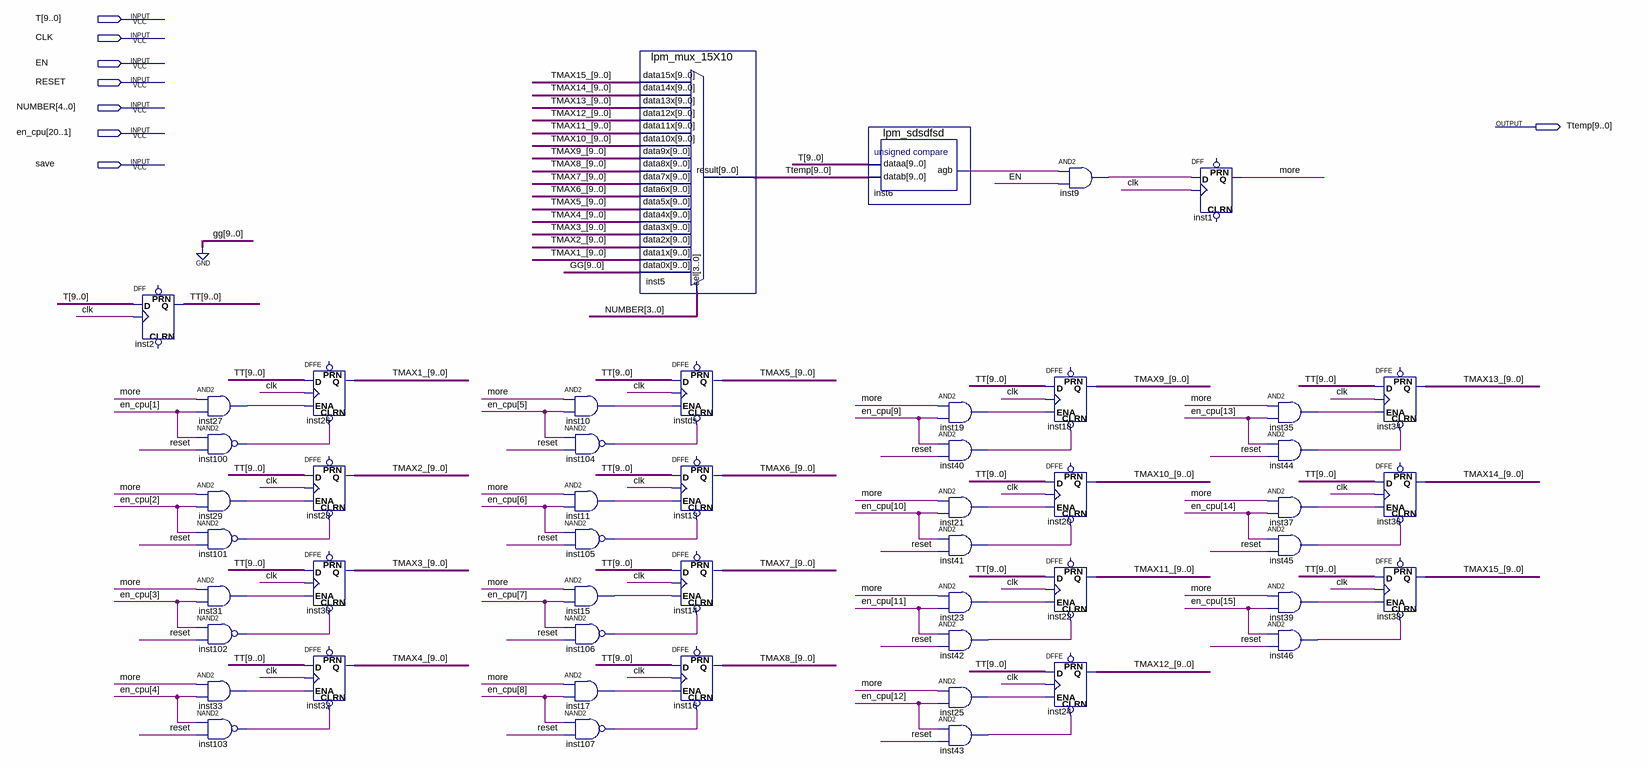
[diagram p0: schematic sheet]
// Quartus schematic Tmax.bdf as structural Verilog: 50 symbols, 8 pins
module Tmax (
  input  [9:0] T,
  input  CLK,
  input  EN,
  input  RESET,
  input  [4:0] NUMBER,
  input  [20:1] en_cpu,
  input  save,
  output [9:0] Ttemp
);

  wire inst6_agb, inst9_out, inst10_out, inst11_out, inst15_out, inst17_out, inst19_out, inst21_out,
       inst23_out, inst25_out, inst27_out, inst29_out, inst31_out, inst33_out, inst35_out, inst37_out,
       inst39_out, inst40_out, inst41_out, inst42_out, inst43_out, inst44_out, inst45_out, inst46_out,
       inst100_out, inst101_out, inst102_out, inst103_out, inst104_out, inst105_out, inst106_out,
       inst107_out, more;
  wire [9:0] TMAX1_, TMAX2_, TMAX3_, TMAX4_, TMAX5_, TMAX6_, TMAX7_, TMAX8_, TMAX9_, TMAX10_, TMAX11_,
       TMAX12_, TMAX13_, TMAX14_, TMAX15_, TT;

  DFF inst2[9:0] (.CLK(CLK), .D(T), .Q(TT));  // open: CLRN, PRN
  and inst27 (inst27_out, more, en_cpu[1]);
  nand inst100 (inst100_out, en_cpu[1], RESET);
  and inst29 (inst29_out, more, en_cpu[2]);
  nand inst101 (inst101_out, en_cpu[2], RESET);
  and inst31 (inst31_out, more, en_cpu[3]);
  nand inst102 (inst102_out, en_cpu[3], RESET);
  and inst33 (inst33_out, more, en_cpu[4]);
  nand inst103 (inst103_out, en_cpu[4], RESET);
  DFFE inst26[9:0] (.CLRN(inst100_out), .D(TT), .CLK(CLK), .ENA(inst27_out), .Q(TMAX1_));  // open: PRN
  DFFE inst28[9:0] (.CLRN(inst101_out), .D(TT), .CLK(CLK), .ENA(inst29_out), .Q(TMAX2_));  // open: PRN
  DFFE inst30[9:0] (.CLRN(inst102_out), .D(TT), .CLK(CLK), .ENA(inst31_out), .Q(TMAX3_));  // open: PRN
  DFFE inst32[9:0] (.CLRN(inst103_out), .D(TT), .CLK(CLK), .ENA(inst33_out), .Q(TMAX4_));  // open: PRN
  and inst10 (inst10_out, more, en_cpu[5]);
  nand inst104 (inst104_out, en_cpu[5], RESET);
  and inst11 (inst11_out, more, en_cpu[6]);
  nand inst105 (inst105_out, en_cpu[6], RESET);
  and inst15 (inst15_out, more, en_cpu[7]);
  nand inst106 (inst106_out, en_cpu[7], RESET);
  and inst17 (inst17_out, more, en_cpu[8]);
  nand inst107 (inst107_out, en_cpu[8], RESET);
  lpm_mux_15X10 inst5 (
    .data15x(TMAX15_), .data14x(TMAX14_), .data13x(TMAX13_), .data12x(TMAX12_), .data11x(TMAX11_),
    .data10x(TMAX10_), .data9x(TMAX9_), .data8x(TMAX8_), .data7x(TMAX7_), .data6x(TMAX6_), .data5x(TMAX5_),
    .data4x(TMAX4_), .data3x(TMAX3_), .data2x(TMAX2_), .data1x(TMAX1_), .data0x({10{1'b0}}),
    .sel(NUMBER[3:0]), .result(Ttemp));
  DFFE instds[9:0] (.CLRN(inst104_out), .D(TT), .CLK(CLK), .ENA(inst10_out), .Q(TMAX5_));  // open: PRN
  DFFE inst13[9:0] (.CLRN(inst105_out), .D(TT), .CLK(CLK), .ENA(inst11_out), .Q(TMAX6_));  // open: PRN
  DFFE inst14[9:0] (.CLRN(inst106_out), .D(TT), .CLK(CLK), .ENA(inst15_out), .Q(TMAX7_));  // open: PRN
  DFFE inst16[9:0] (.CLRN(inst107_out), .D(TT), .CLK(CLK), .ENA(inst17_out), .Q(TMAX8_));  // open: PRN
  lpm_sdsdfsd inst6 (.dataa(T), .datab(Ttemp), .agb(inst6_agb));
  and inst19 (inst19_out, more, en_cpu[9]);
  and inst40 (inst40_out, en_cpu[9], RESET);
  and inst21 (inst21_out, more, en_cpu[10]);
  and inst41 (inst41_out, en_cpu[10], RESET);
  and inst23 (inst23_out, more, en_cpu[11]);
  and inst42 (inst42_out, en_cpu[11], RESET);
  and inst25 (inst25_out, more, en_cpu[12]);
  and inst43 (inst43_out, en_cpu[12], RESET);
  and inst9 (inst9_out, inst6_agb, EN);
  DFFE inst18[9:0] (.CLRN(inst40_out), .D(TT), .CLK(CLK), .ENA(inst19_out), .Q(TMAX9_));  // open: PRN
  DFFE inst20[9:0] (.CLRN(inst41_out), .D(TT), .CLK(CLK), .ENA(inst21_out), .Q(TMAX10_));  // open: PRN
  DFFE inst22[9:0] (.CLRN(inst42_out), .D(TT), .CLK(CLK), .ENA(inst23_out), .Q(TMAX11_));  // open: PRN
  DFFE inst24[9:0] (.CLRN(inst43_out), .D(TT), .CLK(CLK), .ENA(inst25_out), .Q(TMAX12_));  // open: PRN
  DFF inst1 (.CLK(CLK), .D(inst9_out), .Q(more));  // open: CLRN, PRN
  and inst35 (inst35_out, more, en_cpu[13]);
  and inst44 (inst44_out, en_cpu[13], RESET);
  and inst37 (inst37_out, more, en_cpu[14]);
  and inst45 (inst45_out, en_cpu[14], RESET);
  and inst39 (inst39_out, more, en_cpu[15]);
  and inst46 (inst46_out, en_cpu[15], RESET);
  DFFE inst34[9:0] (.CLRN(inst44_out), .D(TT), .CLK(CLK), .ENA(inst35_out), .Q(TMAX13_));  // open: PRN
  DFFE inst36[9:0] (.CLRN(inst45_out), .D(TT), .CLK(CLK), .ENA(inst37_out), .Q(TMAX14_));  // open: PRN
  DFFE inst38[9:0] (.CLRN(inst46_out), .D(TT), .CLK(CLK), .ENA(inst39_out), .Q(TMAX15_));  // open: PRN
endmodule
